# Altium schematic sheet [06] - WI-FI MODULE.SchDoc: Desk Digital Clock
size A4; DrawnBy: Ramil Teregulov; Address1: http://github.com/teregulov; Address2: http://github.com/teregulov/Desk-Digital-Clock; DocumentNumber: DDC-6; Revision: 1R0; SheetNumber: 6; SheetTotal: 7
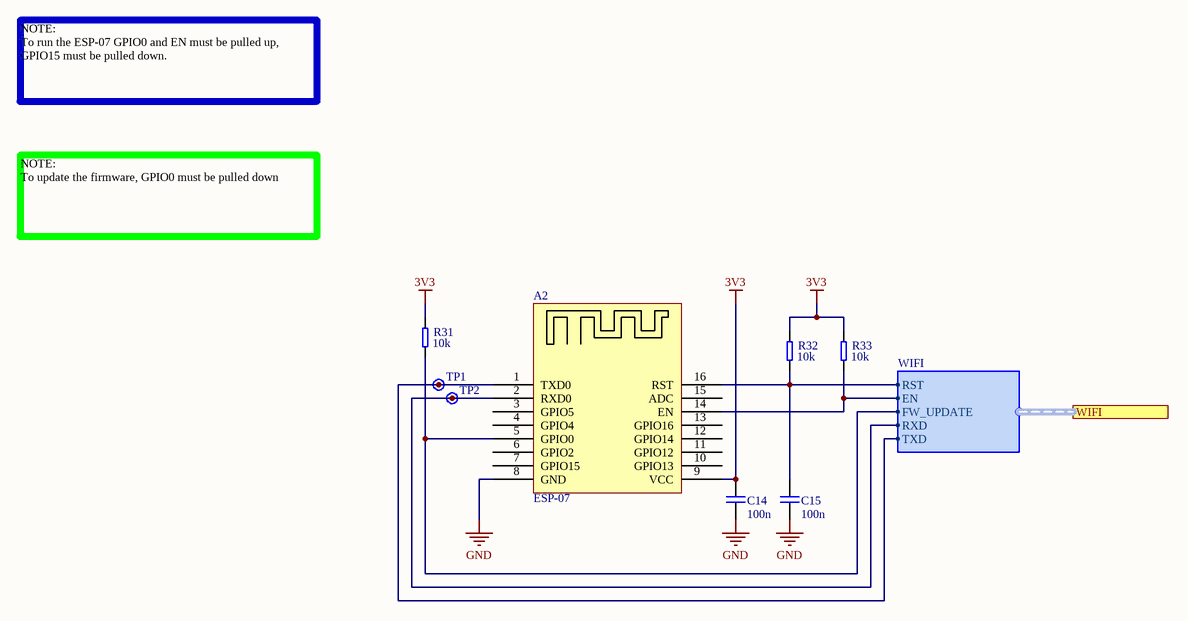
[diagram p0: [06] - WI-FI MODULE.SchDoc]

## Parts
A2  ESP-07
C14  100n
C15  100n
R31  10k
R32  10k
R33  10k
TP1  Test Point  (value not drawn)  (no BOM)
TP2  Test Point  (value not drawn)  (no BOM)

## Ports
WIFI (harness WIFI)

## Harnesses
WIFI: TXD, RXD, FW_UPDATE, EN, RST

## Nets
3V3: A2.9(VCC) C14.2 R31.2 R32.2 R33.2
GND: A2.8(GND) C14.1 C15.1
NetA2_1: A2.1(TXD0) TP1.1 ; port WIFI.TXD
NetA2_2: A2.2(RXD0) TP2.1 ; port WIFI.RXD
NetA2_5: A2.5(GPIO0) R31.1 ; port WIFI.FW_UPDATE
NetA2_14: A2.14(EN) R33.1 ; port WIFI.EN
NetA2_16: A2.16(RST) C15.2 R32.1 ; port WIFI.RST

Not connected (* = marked no-connect by the designer): A2 3(GPIO5) 4(GPIO4) 6(GPIO2) 7(GPIO15) 10(GPIO13) 11(GPIO12) 12(GPIO14) 13(GPIO16) 15(ADC)

## Notes on the sheet
- NOTE:
  To run the ESP-07 GPIO0 and EN must be pulled up,
  GPIO15 must be pulled down.
- NOTE:
  To update the firmware, GPIO0 must be pulled down
- Title:
- Size:
- Date:
- A4
- Number:
- Time:
- Revision:
- Sheet
- of
- File:

## Library data of the parts
A2 = ESP-07: ESP8266 WIFI 802.11B/G/N 160MBIT; Manufacturer: AI Thinker; Datasheet: https://wiki.ai-thinker.com/_media/esp8266/esp8266_series_modules_user_manual_v1.1.pdf; P/N: ESP-07
C14 C15 = Cap: CAPACITOR; Value: 100n
R31-R33 = Res: RESISTOR; Value: 10k